# Altium schematic sheet PCIe_USB30_Conn_Internal_Vertical.SchDoc
size A
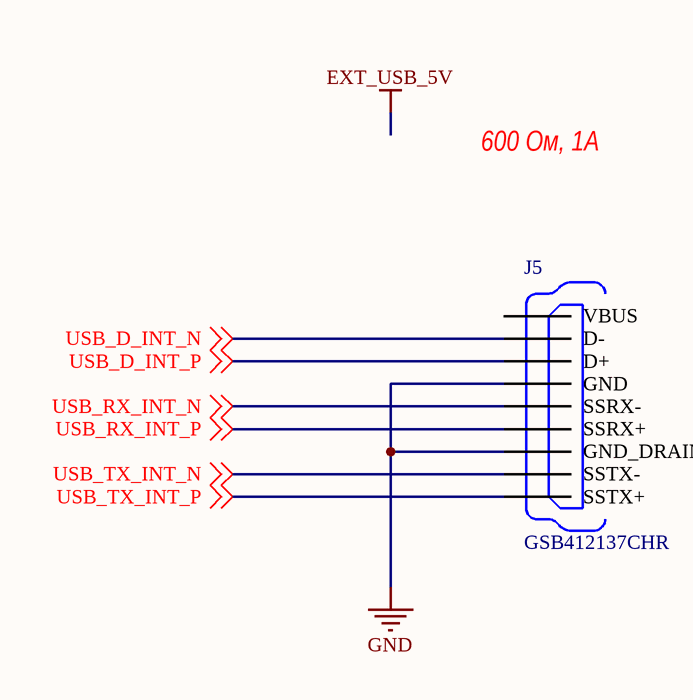
[diagram p0: PCIe_USB30_Conn_Internal_Vertical.SchDoc]

## Parts
J5  GSB412137CHR  [AMPHENOL_GSB412137CHR]

## Nets
GND: J5.4(GND) J5.7(GND_DRAIN)
USB_D_INT_N: J5.2(D-) ; off-sheet USB_D_INT_N
USB_D_INT_P: J5.3(D+) ; off-sheet USB_D_INT_P
USB_RX_INT_N: J5.5(SSRX-) ; off-sheet USB_RX_INT_N
USB_RX_INT_P: J5.6(SSRX+) ; off-sheet USB_RX_INT_P
USB_TX_INT_N: J5.8(SSTX-) ; off-sheet USB_TX_INT_N
USB_TX_INT_P: J5.9(SSTX+) ; off-sheet USB_TX_INT_P

Not connected (* = marked no-connect by the designer): J5 1(VBUS)

## Notes on the sheet
- 600 Ом, 1А

## Library data of the parts
J5 = GSB412137CHR: USB-A _USB TYPE-A_ USB 3.1 _USB 3.1 Gen 2, Superspeed+_ Receptacle Connector 9 Position Through Hole; MF: Amphenol ICC; MP: GSB412137CHR; Digi-Key_Part_Number: GSB412137CHR-ND; Package: None; Digi-Key_Purchase_URL: https://www.digikey.com/product-detail/en/amphenol-icc-commercial-products/GSB412137CHR/GSB412137CHR-ND/4883784?utm_source=snapeda&utm_medium=aggregator&utm_campaign=symbol; Value: *; SnapEDA_Link: https://www.snapeda.com/parts/GSB412137CHR/Amphenol%20FCI/view-part/480805/?ref=snap